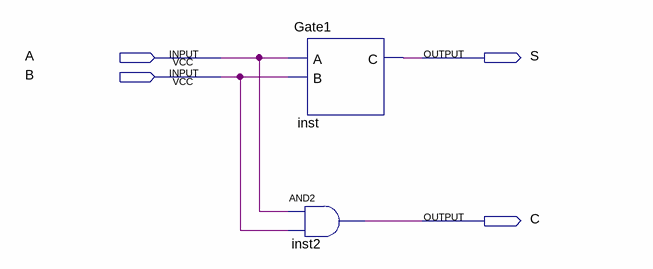
[diagram p0: schematic sheet]
// Quartus schematic Halfadder.bdf as structural Verilog: 2 symbols, 4 pins
module Halfadder (
  input  A,
  input  B,
  output S,
  output C
);

  Gate1 inst (.A(A), .B(B), .C(S));
  and inst2 (C, A, B);
endmodule
